# Altium schematic sheet v4.2.1 Embutida.SchDoc
size 301 x 384 mm; Origin: Eagle; OriginPath: D:\Projetos\Etilometro\Eletrônica\Placas EAGLE\Embutidas\v4.2.1 Embutida\v4.2.1 Embutida.sch; OriginSheet: 1
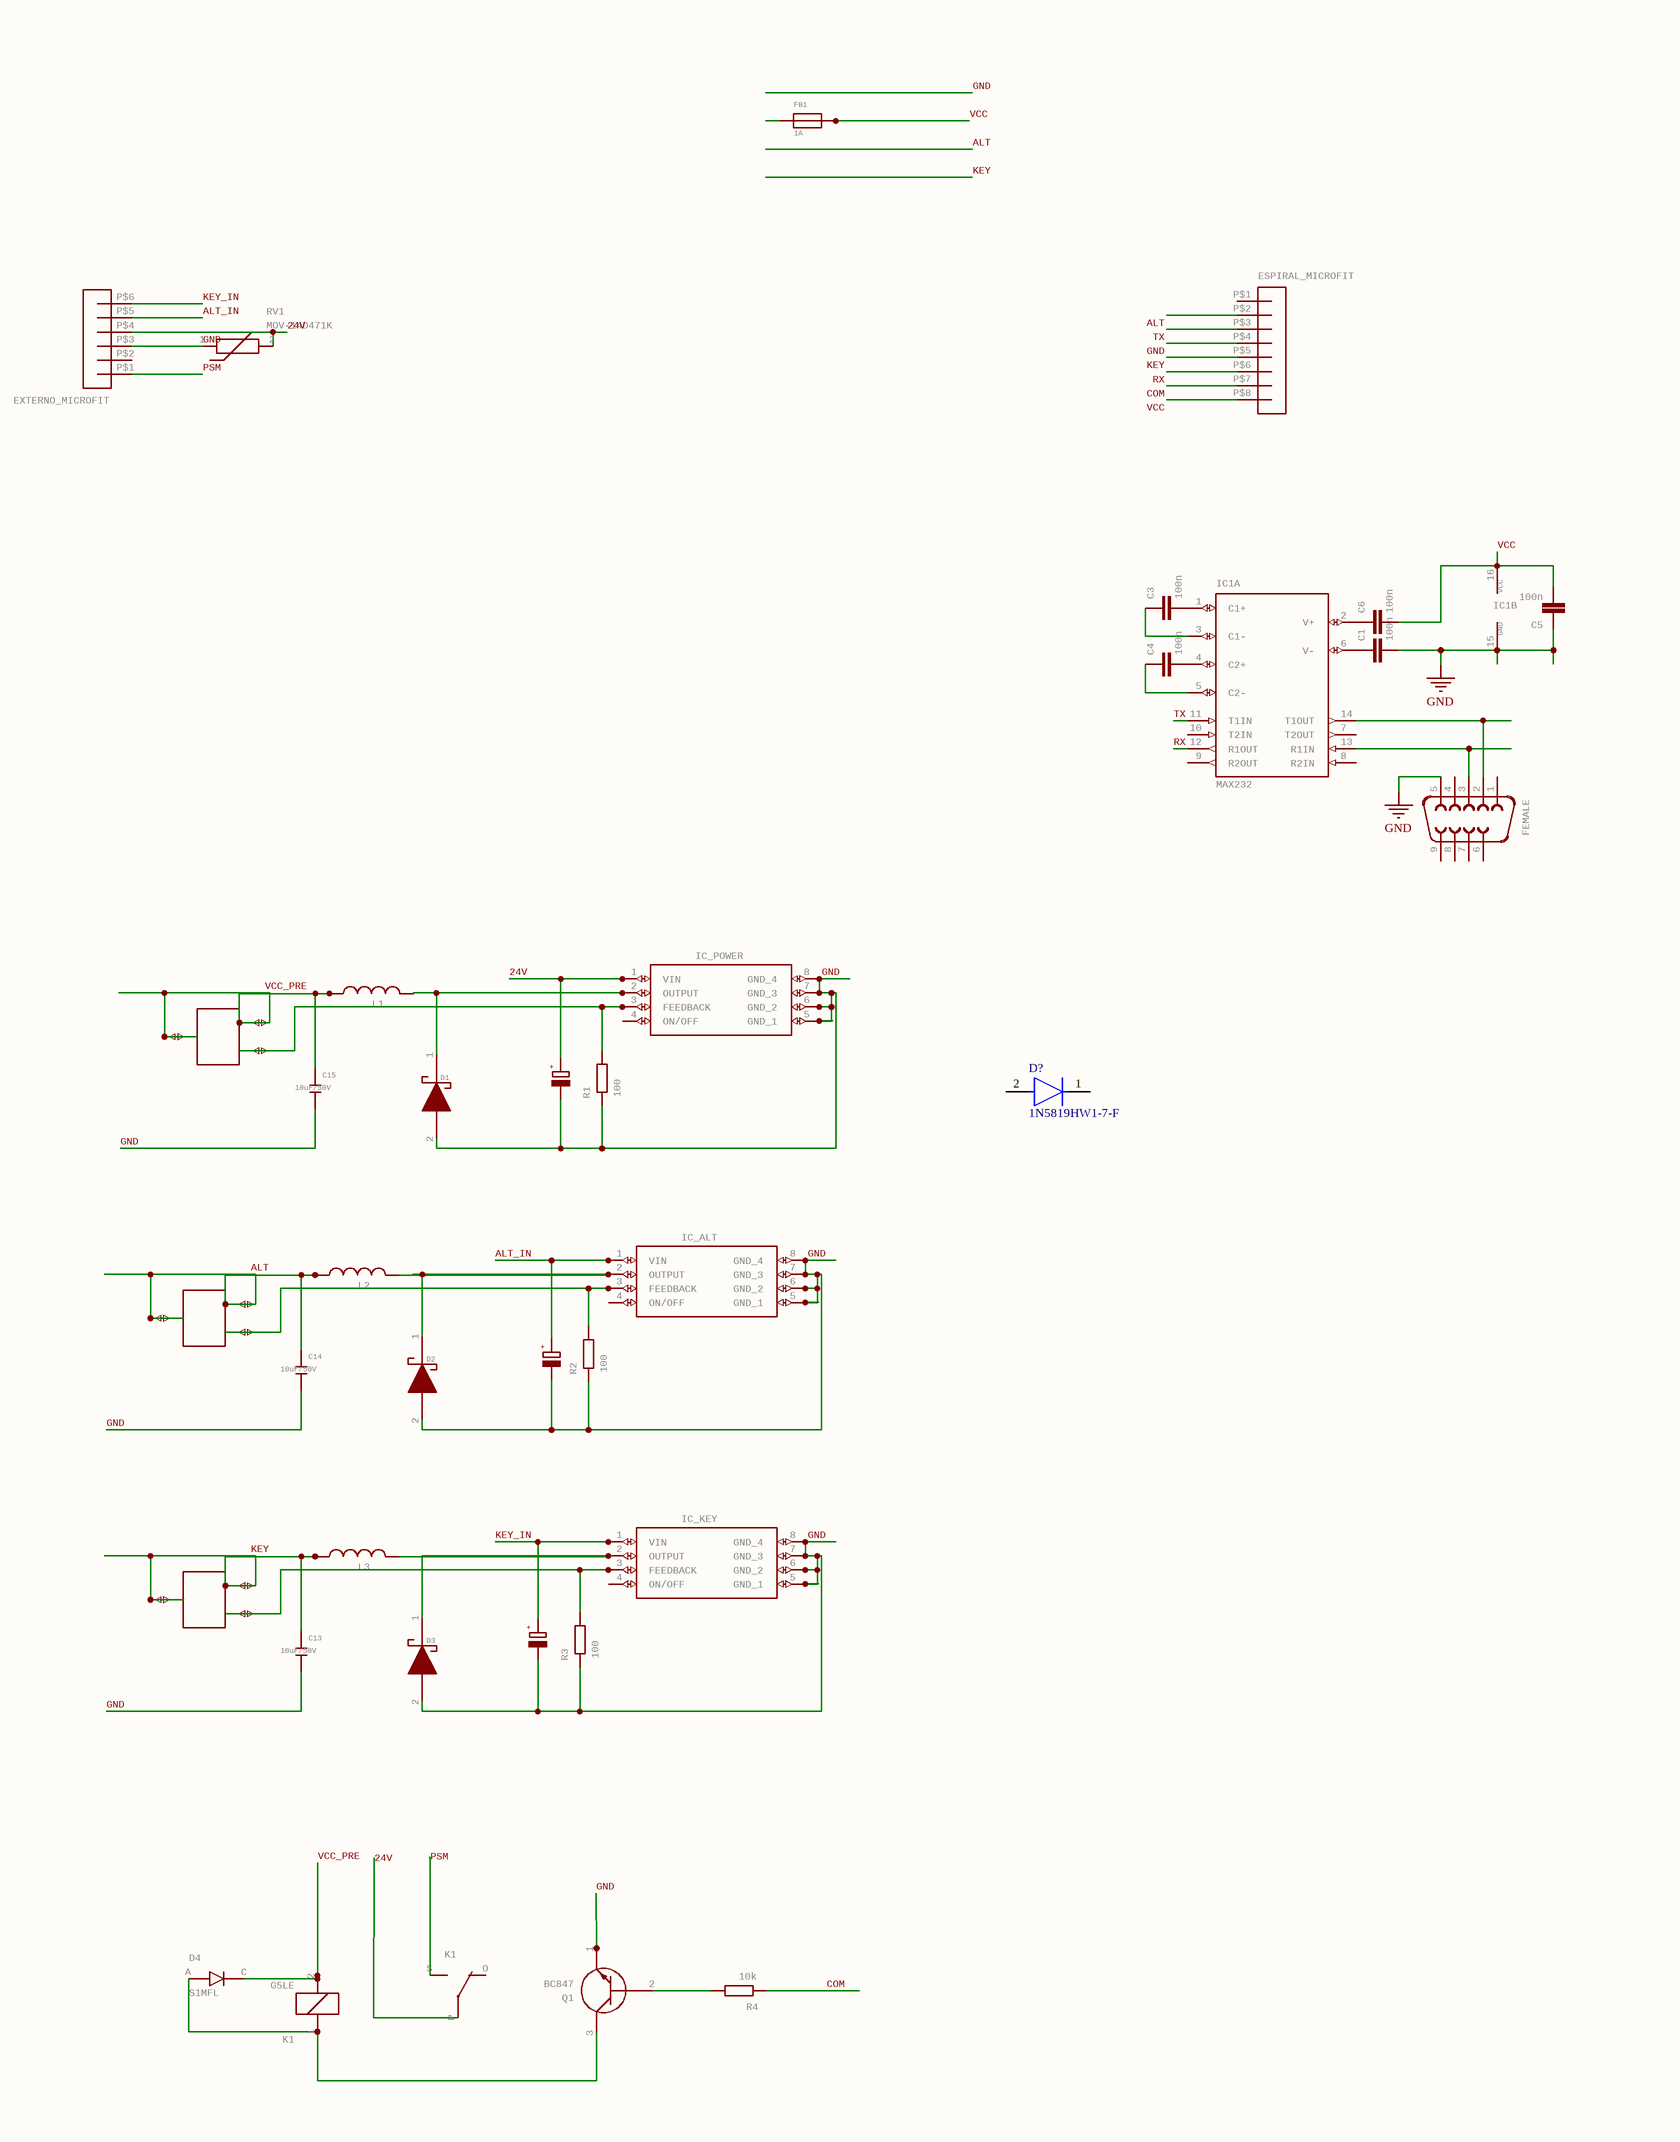
[diagram p0: v4.2.1 Embutida.SchDoc]

## Parts
C1  100n  [C0805]
C2  22uF/50v  [PANASONIC_D]  (value not drawn)
C3  100n  [C0805]
C4  100n  [C0805]
C5  100n  [C0805]
C6  100n  [C0805]
C8  22uF/50V  [PANASONIC_D]  (value not drawn)
C9  22uF/50V  [PANASONIC_D]  (value not drawn)
C13  10uF/50V  [C0805]
C14  10uF/50V  [C0805]
C15  10uF/50V  [C0805]
D1  1N5819HW1-7-F  [SODFL3518X115N]  (value not drawn)
D2  1N5819HW1-7-F  [SODFL3518X115N]  (value not drawn)
D3  1N5819HW1-7-F  [SODFL3518X115N]  (value not drawn)
D4  S1MFL  [SODFL3617X108N]
D?  1N5819HW1-7-F  [FP-SOD123F_Type_B-MFG]
ESPIRAL_MICROFIT  HEADER_POS8_?43045-0800  [43045-0800]  (value not drawn)
EXTERNO_MICROFIT  HEADER_POS6_?43045-0600  [43045-0600]  (value not drawn)
FB1  1A  [0805]
FEMALE  F09H  [F09H]  (value not drawn)
IC1  MAX232  [SO16]  (parts A,B of 2)
IC_ALT  XL1509-3.3E1  [SOIC127P600X175-8N]  (value not drawn)
IC_KEY  XL1509-3.3E1  [SOIC127P600X175-8N]  (value not drawn)
IC_POWER  XL1509-3.3E1  [SOIC127P600X175-8N]  (value not drawn)
K1  G5LE  PART: K1  [G5LE]  (parts A,B of 2)
L1  47uH  [SDE0604A-470M]  (value not drawn)
L2  47uH  [SDE0604A-470M]  (value not drawn)
L3  47uH  [SDE0604A-470M]  (value not drawn)
Q1  BC847  [BC847]
R1  100  [R0805]
R2  100  [R0805]
R3  100  [R0805]
R4  10k  [R0805]
RV1  MOV-14D471K  [MOV14D471K]
T1  TRIMPOT 10K  [TRIMPOT]  (value not drawn)
T2  TRIMPOT 10K  [TRIMPOT]  (value not drawn)
T3  TRIMPOT 10K  [TRIMPOT]  (value not drawn)

## Nets
GND: C1.2 C2.- C5.1 C8.- C9.- C13.1 C14.1 C15.1 D1.2(A) D2.2(A) D3.2(A) ESPIRAL_MICROFIT.P$4 EXTERNO_MICROFIT.P$3 FEMALE.5 IC1.15(GND) IC_ALT.5(GND_1) IC_ALT.6(GND_2) IC_ALT.7(GND_3) IC_ALT.8(GND_4) IC_KEY.5(GND_1) IC_KEY.6(GND_2) IC_KEY.7(GND_3) IC_KEY.8(GND_4) IC_POWER.5(GND_1) IC_POWER.6(GND_2) IC_POWER.7(GND_3) IC_POWER.8(GND_4) Q1.1(E) R1.1 R2.1 R3.1 RV1.1
24V: C2.+ EXTERNO_MICROFIT.P$4 IC_POWER.1(VIN) K1.P RV1.2
ALT: C14.2 ESPIRAL_MICROFIT.P$2 L2.1 T2.VCC1 T2.VCC2
ALT_IN: C8.+ EXTERNO_MICROFIT.P$5 IC_ALT.1(VIN)
COM: ESPIRAL_MICROFIT.P$7 R4.1
KEY: C13.2 ESPIRAL_MICROFIT.P$5 L3.1 T3.VCC1 T3.VCC2
KEY_IN: C9.+ EXTERNO_MICROFIT.P$6 IC_KEY.1(VIN)
PSM: EXTERNO_MICROFIT.P$1 K1.S
RX: ESPIRAL_MICROFIT.P$6 IC1.12(R1OUT)
TX: ESPIRAL_MICROFIT.P$3 IC1.11(T1IN)
VCC: C5.2 C6.2 ESPIRAL_MICROFIT.P$8 FB1.2(P$2) IC1.16(VCC)
VCC_PRE: C15.2 D4.C K1.2 L1.1 T1.VCC1 T1.VCC2
NetC1_1: C1.1 IC1.6(V-)
NetC3_1: C3.1 IC1.3(C1-)
NetC3_2: C3.2 IC1.1(C1+)
NetC4_1: C4.1 IC1.5(C2-)
NetC4_2: C4.2 IC1.4(C2+)
NetC6_1: C6.1 IC1.2(V+)
NetD1_1: D1.1(K) IC_POWER.2(OUTPUT) L1.2
NetD2_1: D2.1(K) IC_ALT.2(OUTPUT) L2.2
NetD3_1: D3.1(K) IC_KEY.2(OUTPUT) L3.2
NetD4_A: D4.A K1.1 Q1.3(C)
NetFEMALE_2: FEMALE.2 IC1.14(T1OUT)
NetFEMALE_3: FEMALE.3 IC1.13(R1IN)
NetIC_ALT_3: IC_ALT.3(FEEDBACK) R2.2 T2.OUT
NetIC_KEY_3: IC_KEY.3(FEEDBACK) R3.2 T3.OUT
NetIC_POWER_3: IC_POWER.3(FEEDBACK) R1.2 T1.OUT
NetQ1_2: Q1.2(B) R4.2

Not connected (* = marked no-connect by the designer): D? 1(C) 2(A); ESPIRAL_MICROFIT P$1(1); EXTERNO_MICROFIT P$2(2); FB1 1(P$1); FEMALE 1 4 6 7 8 9; IC1 7(T2OUT) 8(R2IN) 9(R2OUT) 10(T2IN); IC_ALT 4(ON/OFF); IC_KEY 4(ON/OFF); IC_POWER 4(ON/OFF); K1 O

## Library data of the parts
C1 C3-C6 = C-EUC0805: CAPACITOR, European symbol; MPN: C0805C104K8RACAUTO; GateName_1: G$1; SymbolName_1: C-EU; POPULARITY: 88; DeviceName: C0805; LibraryName: rcl@1; DeviceSetName: C-EU; SPICEPREFIX: C
C2 C8 C9 = CPOL-EUD: POLARIZED CAPACITOR, European symbol; MPN: EEH-ZA1H220P; GateName_1: G$1; SymbolName_1: CPOL; DeviceName: D; POPULARITY: 16; LibraryName: rcl; DeviceSetName: CPOL-EU; +: +; SPICEPREFIX: C
C13-C15 = C*-0805: Ceramic Capacitors; MPN: C2012X5R1H106K125AC; GateName_1: C; DeviceName: -0805; DeviceSetName: C*; SymbolName_1: C; LibraryName: discrete
D1-D3 = 1N5819HW1-7-F: 1N5819 Schottky Diode 40V 1A SOD123F   Source:  Datasheet; MANUFACTURER_NAME: Diodes Inc.; MPN: 1N5822 SS34; GateName_1: G$1; SymbolName_1: 1N5819HW1-7-F; LibraryName: 1N5819HW1-7-F; DeviceSetName: 1N5819HW1-7-F; ARROW_PART_NUMBER: 1N5819HW1-7-F; ARROW_PRICE-STOCK: https://www.arrow.com/en/products/1n5819hw1-7-f/diodes-incorporated?region=nac; HEIGHT: 1.15mm; MANUFACTURER_PART_NUMBER: 1N5819HW1-7-F; MOUSER_PART_NUMBER: 621-1N5819HW1-7-F; MOUSER_PRICE-STOCK: https://www.mouser.co.uk/ProductDetail/Diodes-Incorporated/1N5819HW1-7-F?qs=60RJRzIpcl9ACQG7Zn63jQ%3D%3D
D4 = S1MFL: Diode Standard 1000V 1A Surface Mount SOD-123F   Check availability; GateName_1: G$1; MF: onsemi; SymbolName_1: S1MFL; LibraryName: S1MFL; DeviceSetName: S1MFL; AVAILABILITY: In Stock; CHECK_PRICES: https://www.snapeda.com/parts/S1MFL/Onsemi/view-part/?ref=eda; MP: S1MFL; PACKAGE: SOD-123F ON Semiconductor; PRICE: None; PURCHASE-URL: https://www.snapeda.com/api/url_track_click_mouser/?unipart_id=7151124&manufacturer=onsemi&part_name=S1MFL&search_term=None; SNAPEDA_LINK: https://www.snapeda.com/parts/S1MFL/Onsemi/view-part/?ref=snap
D? = CMP-12791-000028-1: DIODE SBR 40V 1A SOD123F; Manufacturer: Diodes Inc.; Max Junction Temp: +125°C; Capacitance: 30pF; Value: 30pF; Peak Reverse Current: 0.5mA; Max Surge Forward Current: 30A; ComponentLink2Description: Datasheet; Temperature: -55°C to +125°C; Lead Free: Yes; Package: SOD123F (Type B); Reverse Voltage: 40V; Device Class L2: Diodes; Manufacturer Part Number: 1N5819HW1-7-F; ComponentLink2URL: https://www.diodes.com/assets/Datasheets/1N5819HW1.pdf; Automotive: No; RoHS: TRUE; Height: 1.15mm; Digikey Description: DIODE SBR 40V 1A SOD123F; Max Repetitive Reverse Voltage: 40V; Forward Current: 1A; Footprint Url: https://www.diodes.com/assets/Package-Files/SOD123F%20(Type%20B).pdf; Temperature Range High: +125°C; Octopart: https://octopart.com/1n5819hw1-7-f-diodes+inc.-67250096; Mouser Description: Schottky Diodes & Rectifiers 1A SBR 40Vrrm 0.51Vf 0.5mA 28Vrms; Device Class L3: Rectifier Diodes; Ipc Land Pattern Name: SOD350180X98-2; Device Class L1: Discrete Semiconductors; Category: Diode; Temperature Range Low: -55°C
ESPIRAL_MICROFIT = HEADER_POS8_?43045-0800: Molex - Micro-Fit 3.0 Series connector,  3.00mm (0.118") pitch header, 8 positions.; GateName_1: G$1; SymbolName_1: HEADER_POS8; DeviceName: 43045-0800; LibraryName: con-molex-micro-fit-3_0 (1); DeviceSetName: HEADER_POS8_?; MPN: 43045-0800
EXTERNO_MICROFIT = HEADER_POS6_?43045-0600: Molex - Micro-Fit 3.0 Series connector,  3.00mm (0.118") pitch header, 6 positions.; GateName_1: G$1; SymbolName_1: HEADER_POS6; DeviceName: 43045-0600; LibraryName: con-molex-micro-fit-3_0 (1); DeviceSetName: HEADER_POS6_?; MPN: 43045-0600
FB1 = FERRITE0805: Ferrite Bead   0603 MMZ1608B121C - 120 Ohm, 600mA Ferrite Chip - Digikey: 445-2164-1-ND  BK1608HW121-T - 120 Ohm, 600mA Ferrite Chip - Digikey: 587-1876-2-ND       0805 HZ0805B272R-10 - 2.7K Ohm @ 100MHz, 200mA 0.8 Ohm DC Resistance - Digikey: 240-2504-1-ND (see also Murata BLM21BD272SN1L); MPN: BLM21AG121SN1D; GateName_1: G$1; SymbolName_1: FERRITE; DeviceName: 0805; LibraryName: microbuilder; DeviceSetName: FERRITE
FEMALE = F09H: SUB-D; MPN: FEMALE DR9; GateName_1: G$1; SymbolName_1: F09; DeviceName: H; POPULARITY: 0; LibraryName: con-subd; DeviceSetName: F09; MF: MF; OC_FARNELL: unknown; OC_NEWARK: unknown
IC1 = MAX232ECWES: RS232 TRANSEIVER; MPN: MAX3232CSE+; GateName_1: G$1; GateName_2: P; SymbolName_2: VCC-GND; DeviceName: S; SymbolName_1: MAX232; LibraryName: maxim-6b; DeviceSetName: MAX232ECWE
IC_ALT IC_KEY IC_POWER = XL1509-3.3E1: 40V 2A SOP-8_150mil DC-DC Converters RoHS   Source:  Datasheet; MANUFACTURER_NAME: XLSEMI; MPN: XL1509-ADJE1; GateName_1: G$1; SymbolName_1: XL1509-3.3E1; LibraryName: XL1509-3.3E1; DeviceSetName: XL1509-3.3E1; ARROW_PART_NUMBER: ARROW_PART_NUMBER; ARROW_PRICE-STOCK: ARROW_PRICE-STOCK; HEIGHT: 1.75mm; MANUFACTURER_PART_NUMBER: XL1509-3.3E1; MOUSER_PART_NUMBER: MOUSER_PART_NUMBER; MOUSER_PRICE-STOCK: MOUSER_PRICE-STOCK
K1 = G5LE: RELAY   1 x switch, 10 A/120 V AC, 8 A/30 V DC, Omron; GateName_1: 1; SymbolName_1: K; GateName_2: 2; SymbolName_2: U; POPULARITY: 13; LibraryName: relay; DeviceSetName: G5LE; MANUFACTURER: MANUFACTURER; MPN: MPN; PART_STATUS: PART_STATUS
L1-L3 = INDUCTOR: A very specific inductor; GateName_1: G$1; SymbolName_1: INDUCTOR; LibraryName: passives; DeviceSetName: INDUCTOR; MPN: SDE0604A-470M
Q1 = BC847: Epitaxial Planar NPN transistor   Source:  Datasheet; MANUFACTURER_NAME: KEC; GateName_1: G$1; SymbolName_1: BC847; LibraryName: BC847; DeviceSetName: BC847; ARROW_PART_NUMBER: ARROW_PART_NUMBER; ARROW_PRICE-STOCK: ARROW_PRICE-STOCK; HEIGHT: 1.3mm; MANUFACTURER_PART_NUMBER: BC847; MOUSER_PART_NUMBER: MOUSER_PART_NUMBER; MOUSER_PRICE-STOCK: MOUSER_PRICE-STOCK
R1-R4 = R-EU_R0805: RESISTOR, European symbol; MPN: RA73F2A100RBTDF; GateName_1: G$1; SymbolName_1: R-EU; DeviceSetName: R-EU_; POPULARITY: 86; DeviceName: R0805; LibraryName: rcl; SPICEPREFIX: R
RV1 = MOV-14D471K: Bourns MOV-14D Series Metal Oxide Varistor 430pF 50A, Clamping 775V, Varistor 470V   Source:  Datasheet   Check availability; GateName_1: G$1; SymbolName_1: MOV-14D471K; LibraryName: MOV-14D471K; DeviceSetName: MOV-14D471K; AVAILABILITY: In Stock; CHECK_PRICES: https://www.snapeda.com/parts/MOV-14D471K/Bourns/view-part/?ref=eda; MF: Bourns; MP: MOV-14D471K; PACKAGE: Disc-14 Bourns; PRICE: None; SNAPEDA_LINK: https://www.snapeda.com/parts/MOV-14D471K/Bourns/view-part/?ref=snap
T1-T3 = TRIMPOT: MPN: EVM3ESX50B14; GateName_1: G$1; SymbolName_1: TRIMPOT; LibraryName: TRIMPOT; DeviceSetName: TRIMPOT